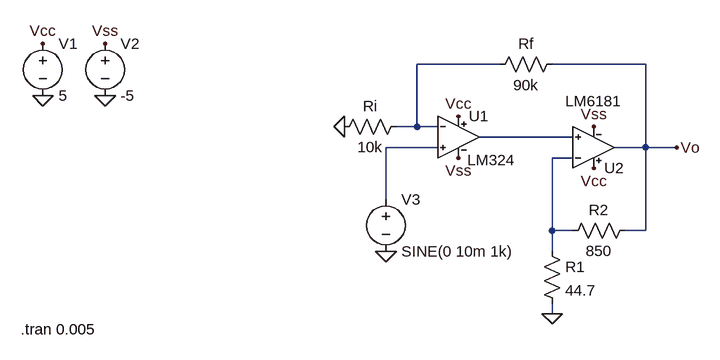
[diagram p0: schematic VFA-CFA.asc]
VFA-CFA.asc, the LTspice schematic file:
Version 4
SHEET 1 880 680
WIRE 192 32 64 32
WIRE 416 32 272 32
WIRE 64 128 64 32
WIRE 64 128 32 128
WIRE 96 128 64 128
WIRE 304 144 160 144
WIRE 96 160 16 160
WIRE 416 160 416 32
WIRE 416 160 368 160
WIRE 464 160 416 160
WIRE 304 176 272 176
WIRE 16 240 16 160
WIRE 272 288 272 176
WIRE 304 288 272 288
WIRE 416 288 416 160
WIRE 416 288 384 288
WIRE 272 320 272 288
WIRE 272 416 272 400
FLAG 272 416 0
FLAG -48 128 0
FLAG 16 320 0
FLAG -512 80 0
FLAG -416 80 0
FLAG -512 0 Vcc
FLAG 128 112 Vcc
FLAG 336 192 Vcc
FLAG -416 0 Vss
FLAG 128 176 Vss
FLAG 336 128 Vss
FLAG 464 160 Vo
SYMBOL AutoGenerated\\LM324 128 144 R0
WINDOW 3 51 20 Top 2
SYMATTR InstName U1
SYMBOL res 256 304 R0
SYMATTR InstName R1
SYMATTR Value 44.7
SYMBOL res 400 272 R90
WINDOW 0 0 56 VBottom 2
WINDOW 3 32 56 VTop 2
SYMATTR InstName R2
SYMATTR Value 850
SYMBOL res 288 16 R90
WINDOW 0 0 56 VBottom 2
WINDOW 3 32 56 VTop 2
SYMATTR InstName Rf
SYMATTR Value 90k
SYMBOL res 48 112 R90
WINDOW 0 0 56 VBottom 2
WINDOW 3 32 56 VTop 2
SYMATTR InstName Ri
SYMATTR Value 10k
SYMBOL voltage -512 -16 R0
WINDOW 123 0 0 Left 0
WINDOW 39 0 0 Left 0
SYMATTR InstName V1
SYMATTR Value 5
SYMBOL voltage -416 -16 R0
WINDOW 123 0 0 Left 0
WINDOW 39 0 0 Left 0
SYMATTR InstName V2
SYMATTR Value -5
SYMBOL voltage 16 224 R0
WINDOW 123 0 0 Left 0
WINDOW 39 0 0 Left 0
SYMATTR InstName V3
SYMATTR Value SINE(0 10m 1k)
SYMBOL AutoGenerated\\LM6181 336 160 M180
SYMATTR InstName U2
TEXT -546 440 Left 2 !.tran 0.005

The netlist it stands for:
* VFA-CFA.asc
XU1 N003 N001 Vcc Vss N002 LM324  ; pins In+ In- V+ V- OUT
R1 N004 0 44.7
R2 Vo N004 850
Rf Vo N001 90k
Ri N001 0 10k
V1 Vcc 0 5
V2 Vss 0 -5
V3 N003 0 SINE(0 10m 1k)
XU2 N002 N004 Vcc Vss Vo LM6181  ; pins In+ In- V+ V- OUT
.tran 0.005
.lib E:\LtSpice_components\LM324.ti.lib
.lib E:\LtSpice_components\LM6181.lib
.backanno
.end